# EAGLE design main_16 (EAGLE 7.4.0)
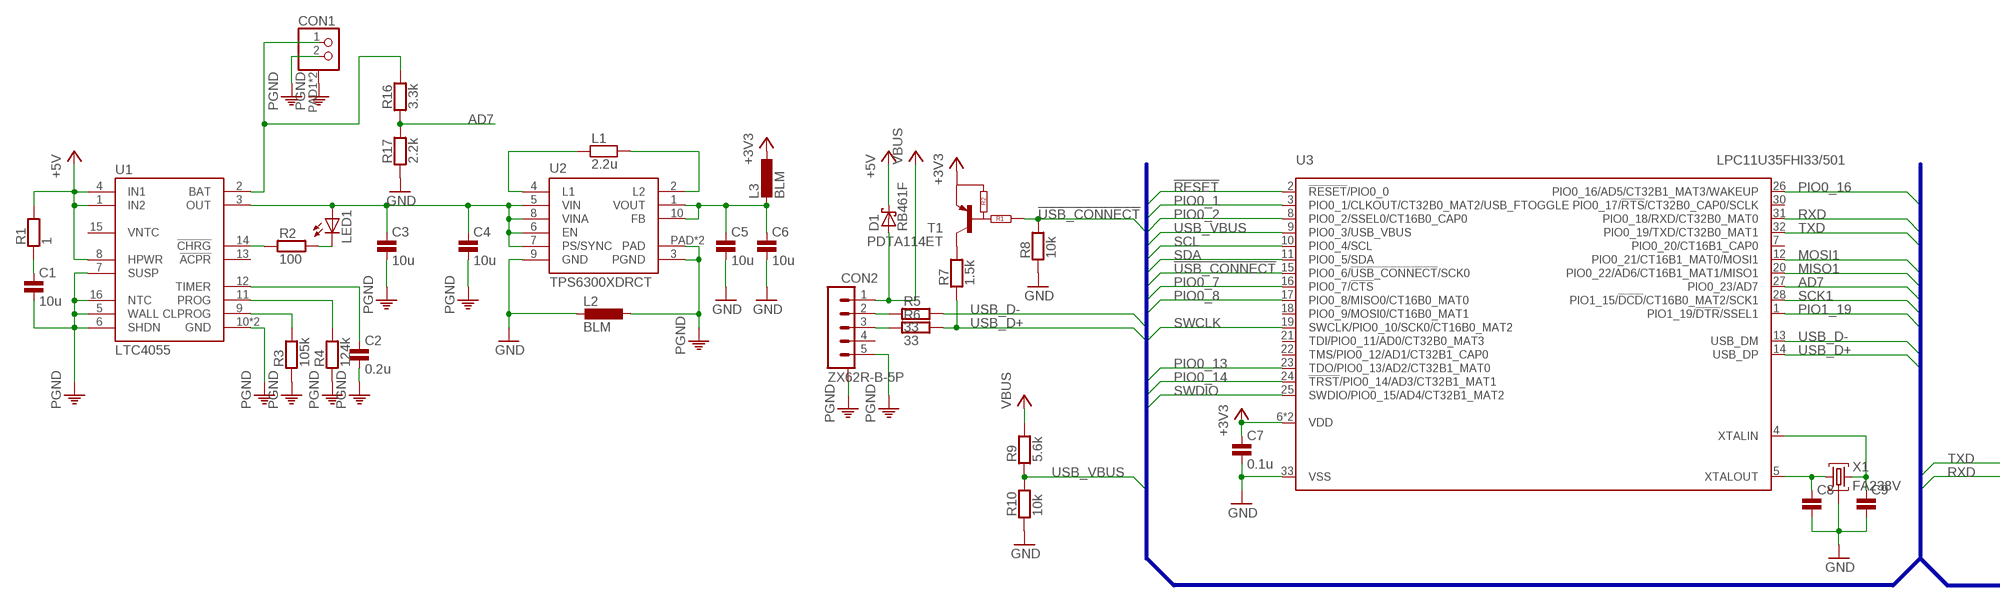
[diagram p0: schematic, sheet 1, part 1 of 2]
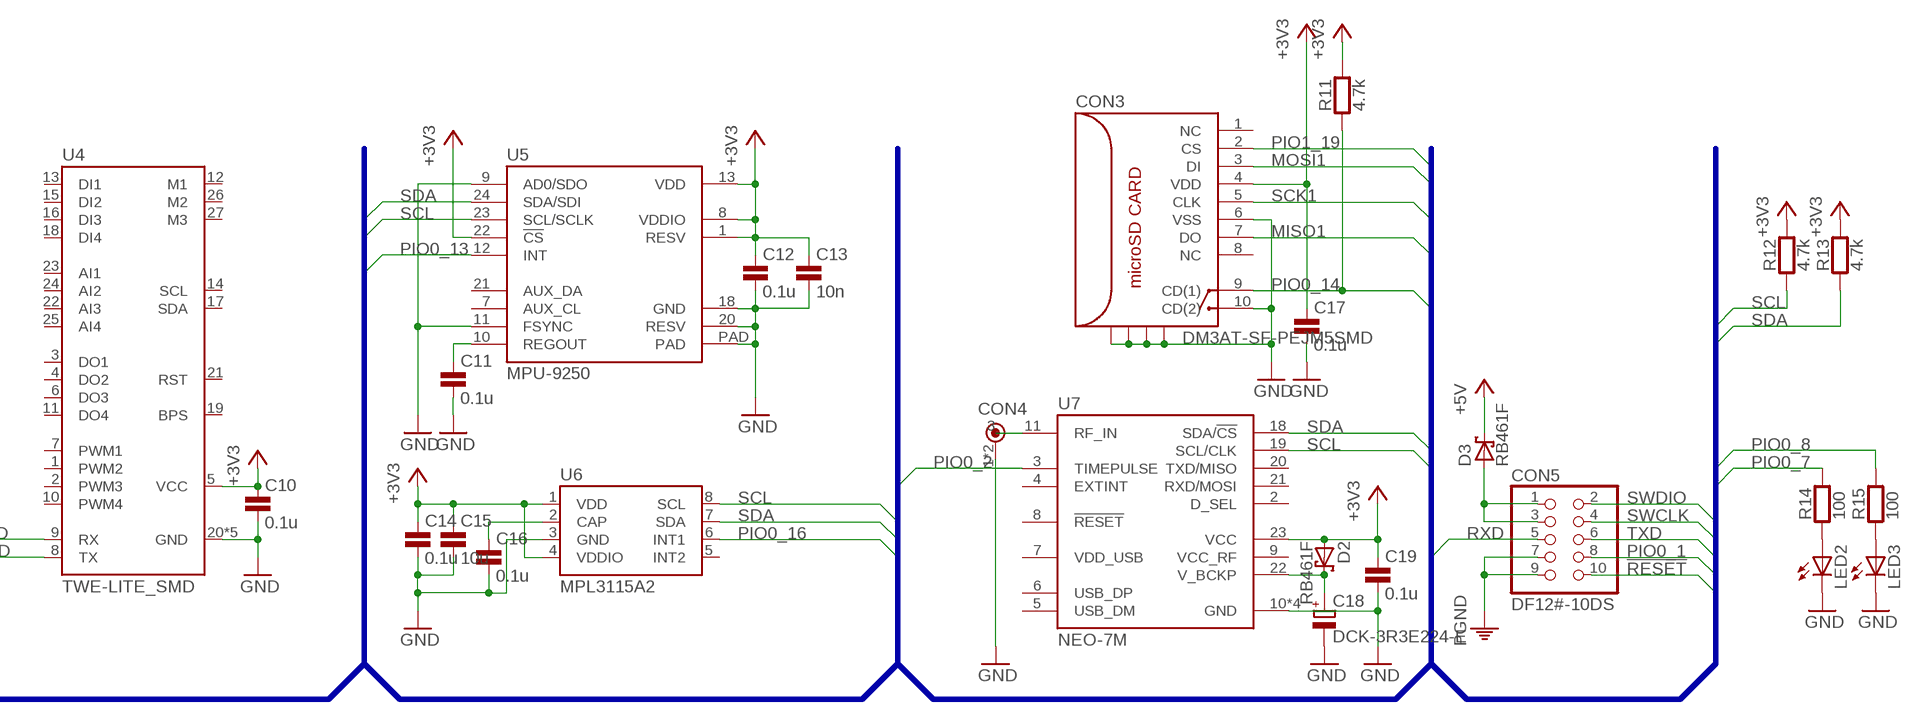
[diagram p1: schematic, sheet 1, part 2 of 2]

## Parts
C1  10u  C0603  [0603]
C2  0.2u  C0402  [0402]
C3  10u  C0603  [0603]
C4  10u  C0603  [0603]
C5  10u  C0603  [0603]
C6  10u  C0603  [0603]
C7  0.1u  C0402  [0402]
C8  C0402  [0402]
C9  C0402  [0402]
C10  0.1u  C0402  [0402]
C11  0.1u  C0402  [0402]
C12  0.1u  C0402  [0402]
C13  10n  C0402  [0402]
C14  0.1u  C0402  [0402]
C15  10u  C0402  [0402]
C16  0.1u  C0402  [0402]
C17  0.1u  C0402  [0402]
C18  DCK-3R3E224-E  [DCK-3R3E224-E]
C19  0.1u  C0402  [0402]
CON1  JST-PH2  [JST-PH2]
CON2  ZX62R-B-5P  [MICRO-B]
CON3  DM3AT-SF-PEJM5SMD  [DM3AT-SF-PEJM5]
CON4  U.FL  [U.FL-R-SMT-1]
CON5  DF12#-10DS  [DF12A-10DS]
D1  RB461F  [UMD3]
D2  RB461F  [UMD3]
D3  RB461F  [UMD3]
L1  2.2u  VLF4012ST  [VLF4012ST]
L2  BLM  L-EU  [C0603K]
L3  BLM  L-EU  [C0603K]
LED1  LEDSML0603  [SML0603]
LED2  LEDSML0603  [SML0603]
LED3  LEDSML0603  [SML0603]
R1  1  R0402  [0402]
R2  100  R0402  [0402]
R3  105k  R0402  [0402]
R4  124k  R0402  [0402]
R5  33  R0402  [0402]
R6  33  R0402  [0402]
R7  1.5k  R0402  [0402]
R8  10k  R0402  [0402]
R9  5.6k  R0402  [0402]
R10  10k  R0402  [0402]
R11  4.7k  R0402  [0402]
R12  4.7k  R0402  [0402]
R13  4.7k  R0402  [0402]
R14  100  R0402  [0402]
R15  100  R0402  [0402]
R16  3.3k  R0402  [0402]
R17  2.2k  R0402  [0402]
T1  PDTA114ET  [SOT23]
U1  LTC4055  [QFN16]
U2  TPS6300XDRCT  [S-PVSON-N10]
U3  LPC11U35FHI33/501  [SOT617-3]
U4  TWE-LITE_SMD  [LITE]
U5  MPU-9250  [MPU-9250]
U6  MPL3115A2  [MPL3115A2]
U7  NEO-7M  [NEO-7M]
X1  FA238V  [V66RA]

## Nets
!RESET!: CON5.10 U3.2(!RESET!/PIO0_0)
!USB_CONNECT!: R8.2 T1.1(INPUT) U3.15(PIO0_6/!USB_CONNECT!/SCK0)
+3V3: C7.1 C10.1 C12.1 C13.1 C14.1 C15.1 C17.1 C19.1 CON3.4(VDD) D2.2(A) L3.1 R11.2 R12.2 R13.2 T1.2(E) U3.6(VDD) U3.29(VDD) U4.5(VCC) U5.1(RESV) U5.8(VDDIO) U5.13(VDD) U5.22(!CS!) U6.1(VDD) U6.4(VDDIO) U7.23(VCC)
+5V: D1.3(C) D3.3(C) R1.2 U1.1(IN2) U1.4(IN1) U1.8(HPWR)
AD7: R16.1 R17.2 U3.27(PIO0_23/AD7)
GND: C5.2 C6.2 C7.2 C8.2 C9.2 C10.2 C11.2 C12.2 C13.2 C14.2 C15.2 C16.2 C17.2 C18.1(-) C19.2 CON3.6(VSS) CON3.10(CD(2)) CON3.P$10 CON3.P$11 CON3.P$12 CON3.P$14 CON4.1(GND) CON4.2(GND) L2.2 LED2.C LED3.C R8.1 R10.1 R17.1 U2.9(GND) U3.33(VSS) U4.20(GND) U4.28(GND) U4.30(GND) U4.31(GND) U4.32(GND) U5.9(AD0/SDO) U5.11(FSYNC) U5.18(GND) U5.20(RESV) U5.PAD U6.3(GND) U7.10(GND) U7.12(GND) U7.13(GND) U7.24(GND) X1.P2GND(GND) X1.P4GND(GND)
MISO1: CON3.7(DO) U3.20(PIO0_22/AD6/CT16B1_MAT1/MISO1)
MOSI1: CON3.3(DI) U3.12(PIO0_21/CT16B1_MAT0/MOSI1)
N$1: C8.1 U3.5(XTALOUT) X1.P1X1(X1)
N$2: CON2.2(2.D-) R5.1
N$3: C9.1 U3.4(XTALIN) X1.P3X2(X2)
N$4: CON2.3(3.D+) R6.1
N$5: R7.2 T1.3(C)
N$6: LED3.A R15.1
N$7: CON4.3(RF) U7.11(RF_IN)
N$8: C16.1 U6.2(CAP)
N$9: L1.2 U2.2(L2)
N$10: C11.1 U5.10(REGOUT)
N$11: L1.1 U2.4(L1)
N$12: LED2.A R14.1
N$16: C1.1 R1.1
N$17: C5.1 C6.1 L3.2 U2.1(VOUT) U2.10(FB)
N$18: CON5.1 CON5.3 D3.2(A)
N$19: R3.2 U1.9(CLPROG)
N$20: R4.2 U1.11(PROG)
N$21: C2.1 U1.12(TIMER)
N$22: R2.1 U1.14(!CHRG!)
N$23: LED1.C R2.2
N$24: C3.1 C4.1 LED1.A U1.3(OUT) U2.5(VIN) U2.6(EN) U2.7(PS/SYNC) U2.8(VINA)
N$25: CON1.1 R16.2 U1.2(BAT)
N$26: C18.2(+) D2.3(C) U7.22(V_BCKP)
PGND: C1.2 C2.2 C3.2 C4.2 CON1.2 CON1.PAD1 CON1.PAD2 CON2.5(5.GND) CON2.CASE@1 CON2.CASE@2 CON2.CASE@3 CON2.CASE@4 CON5.7 CON5.9 L2.1 R3.1 R4.1 U1.5(WALL) U1.6(SHDN) U1.7(SUSP) U1.10(GND) U1.16(NTC) U1.PAD(GND) U2.3(PGND) U2.PAD U2.PAD@1(PAD)
PIO0_1: CON5.8 U3.3(PIO0_1/CLKOUT/CT32B0_MAT2/USB_FTOGGLE)
PIO0_2: U3.8(PIO0_2/SSEL0/CT16B0_CAP0) U7.3(TIMEPULSE)
PIO0_7: R14.2 U3.16(PIO0_7/!CTS!)
PIO0_8: R15.2 U3.17(PIO0_8/MISO0/CT16B0_MAT0)
PIO0_13: U3.23(TDO/PIO0_13/AD2/CT32B1_MAT0) U5.12(INT)
PIO0_14: CON3.9(CD(1)) R11.1 U3.24(!TRST!/PIO0_14/AD3/CT32B1_MAT1)
PIO0_16: U3.26(PIO0_16/AD5/CT32B1_MAT3/WAKEUP) U6.6(INT1)
PIO1_19: CON3.2(CS) U3.1(PIO1_19/!DTR!/SSEL1)
RXD: CON5.5 U3.31(PIO0_18/RXD/CT32B0_MAT0) U4.8(TX)
SCK1: CON3.5(CLK) U3.28(PIO1_15/!DCD!/CT16B0_MAT2/SCK1)
SCL: R12.1 U3.10(PIO0_4/SCL) U5.23(SCL/SCLK) U6.8(SCL) U7.19(SCL/CLK)
SDA: R13.1 U3.11(PIO0_5/SDA) U5.24(SDA/SDI) U6.7(SDA) U7.18(SDA/!CS!)
SWCLK: CON5.4 U3.19(SWCLK/PIO0_10/SCK0/CT16B0_MAT2)
SWDIO: CON5.2 U3.25(SWDIO/PIO0_15/AD4/CT32B1_MAT2)
TXD: CON5.6 U3.32(PIO0_19/TXD/CT32B0_MAT1) U4.9(RX)
USB_D+: R6.2 R7.1 U3.14(USB_DP)
USB_D-: R5.2 U3.13(USB_DM)
USB_VBUS: R9.1 R10.2 U3.9(PIO0_3/USB_VBUS)
VBUS: CON2.1(1.VBUS) D1.2(A) R9.2
Unconnected: CON2.4(4.ID) CON3.1(NC) CON3.8(NC) U1.13(!ACPR!) U3.7(PIO0_20/CT16B1_CAP0) U3.18(PIO0_9/MOSI0/CT16B0_MAT1) U3.21(TDI/PIO0_11/AD0/CT32B0_MAT3) U3.22(TMS/PIO0_12/AD1/CT32B1_CAP0) U3.30(PIO0_17/!RTS!/CT32B0_CAP0/SCLK) U4.1(PWM2) U4.2(PWM3) U4.3(DO1) U4.4(DO2) U4.6(DO3) U4.7(PWM1) U4.10(PWM4) U4.11(DO4) U4.12(M1) U4.13(DI1) U4.14(SCL) U4.15(DI2) U4.16(DI3) U4.17(SDA) U4.18(DI4) U4.19(BPS) U4.21(RST) U4.22(AI3) U4.23(AI1) U4.24(AI2) U4.25(AI4) U4.26(M2) U4.27(M3) U5.7(AUX_CL) U5.21(AUX_DA) U6.5(INT2) U7.2(D_SEL) U7.4(EXTINT) U7.5(USB_DM) U7.6(USB_DP) U7.8(!RESET!) U7.9(VCC_RF) U7.20(TXD/MISO) U7.21(RXD/MOSI)

## Buses
PIO0_0,PIO0_1,PIO0_2,PIO0_3,PIO0_4,PIO0_5,PIO0_6,PIO0_7,PIO0_8,PIO0_9,PIO0_10,PIO0_11,PIO0_12,PIO0_13,PIO0_14,PIO0_15,PIO0_16,PIO0_17,PIO0_18,PIO0_19,PIO0_20,PIO0_21,PIO0_22,PIO0_23,PIO1_15,PIO1_19,!RESET!,SWCLK,SWDIO,RXD,TXD,SCL,SDA,MISO0,MOSI0,SCK0,MISO1,MOSI1,SCK1,AD1,AD7,USB_VBUS,!USB_CONNECT!,USB_D+,USB_D-

## Power pins joined to a net without a drawn wire
VDD_USB: U7.7(VDD_USB)
VNTC: U1.15(VNTC)

## Library data of the parts
C1-C17 C19 = untitled:C: CAPACITOR
C18 = untitled:DCK-3R3E224-E
CON1 = untitled:JST-PH2
CON2 = untitled:ZX62R-B-5P
CON3 = untitled:DM3AT-SF-PEJM5
CON4 = untitled:U.FL
CON5 = untitled:DF12#-10
D1-D3 = untitled:RB461F
L1 = untitled:VLF4012ST
L2 L3 = rcl:L-EU: INDUCTOR, European symbol
LED1-LED3 = led:LED: LED OSRAM: - CHIPLED LG R971, LG N971, LY N971, LG Q971, LY Q971, LO R971, LY R971 LH N974, LH R974 LS Q976, LO Q976, LY Q976 LO Q996 - Hyper CHIPLED LW Q18S LB Q993, LB Q99A, LB R99A - SideLED LS A670, LO A670, LY A670, LG A670, LP A670 LB A673, LV A673, LT A673, LW A673 LH A674 LY A675 LS A676, LA A676, LO A676, LY A676, LW A676 LS A679, LY A679, LG A679 - Hyper Micro SIDELED® LS Y876, LA Y876, LO Y876, LY Y876 LT Y87S - SmartLED LW L88C, LW L88S LB L89C, LB L89S, LG L890 LS L89K, LO L89K, LY L89K LS L896, LA L896, LO L896, LY L896 - TOPLED LS T670, LO T670, LY T670, LG T670, LP T670 LSG T670, LSP T670, LSY T670, LOP T670, LYG T670 LG T671, LOG T671, LSG T671 LB T673, LV T673, LT T673, LW T673 LH T674 LS T676, LA T676, LO T676, LY T676, LB T676, LH T676, LSB T676, LW T676 LB T67C, LV T67C, LT T67C, LS T67K, LO T67K, LY T67K, LW E67C LS E67B, LA E67B, LO E67B, LY E67B, LB E67C, LV E67C, LT E67C LW T67C LS T679, LY T679, LG T679 LS T770, LO T770, LY T770, LG T770, LP T770 LB T773, LV T773, LT T773, LW T773 LH T774 LS E675, LA E675, LY E675, LS T675 LS T776, LA T776, LO T776, LY T776, LB T776 LHGB T686 LT T68C, LB T68C - Hyper Mini TOPLED® LB M676 - Mini TOPLED Santana® LG M470 LS M47K, LO M47K, LY M47K Source: http://www.osram.convergy.de LUXEON: - LUMILED® LXK2-PW12-R00, LXK2-PW12-S00, LXK2-PW14-U00, LXK2-PW14-V00 LXK2-PM12-R00, LXK2-PM12-S00, LXK2-PM14-U00 LXK2-PE12-Q00, LXK2-PE12-R00, LXK2-PE12-S00, LXK2-PE14-T00, LXK2-PE14-U00 LXK2-PB12-K00, LXK2-PB12-L00, LXK2-PB12-M00, LXK2-PB14-N00, LXK2-PB14-P00, LXK2-PB14-Q00 LXK2-PR12-L00, LXK2-PR12-M00, LXK2-PR14-Q00, LXK2-PR14-R00 LXK2-PD12-Q00, LXK2-PD12-R00, LXK2-PD12-S00 LXK2-PH12-R00, LXK2-PH12-S00 LXK2-PL12-P00, LXK2-PL12-Q00, LXK2-PL12-R00 Source: www.luxeon.com KINGBRIGHT: KA-3528ASYC Source: www.kingbright.com
R1-R17 = untitled:R: RESISTOR
T1 = untitled:PDTA114: PNP Resistor-Equipped Transistor (RET) family in small Surface-Mounted Device (SMD) plastic packages. AAL Eindhoven MK
U1 = untitled:LTC4055
U2 = untitled:TPS6300XDRCT
U3 = untitled:LPC11U35FHI33: 32-bit ARM Cortex-M0 microcontroller; up to 128 kB flash; up to 12 kB SRAM and 4 kB EEPROM; USB device; USART The LPC11U3x are a ARM Cortex-M0 based, low-cost 32-bit MCU family, designed for 8/16-bit microcontroller applications, offering performance, low power, simple instruction set and memory addressing together with reduced code size compared to existing 8/16-bit architectures. The LPC11U3x operate at CPU frequencies of up to 50 MHz. Equipped with a highly flexible and configurable Full Speed USB 2.0 device controller, the LPC11U3x brings unparalleled design flexibility and seamless integration to today’s demanding connectivity solutions. The peripheral complement of the LPC11U3x includes up to 128 kB of flash memory, up to 12 kB of SRAM data memory and 4 kB EEPROM, one Fast-mode Plus I 2 C-bus interface, one RS-485/EIA-485 USART with support for synchronous mode and smart card interface, two SSP interfaces, four general purpose counter/timers, a 10-bit ADC, and up to 54 general purpose I/O pins. AAL Eindhoven MK; FLASH: 64kB; GPIO: 26; SRAM: 12kB
U4 = untitled:TWE-LITE
U5 = untitled:MPU-9250
U6 = untitled:MPL3115A2
U7 = untitled:NEO-7M
X1 = untitled:FA238V: EPSON TOYOCOM CRYSTAL V66RA package FA238V

## Board
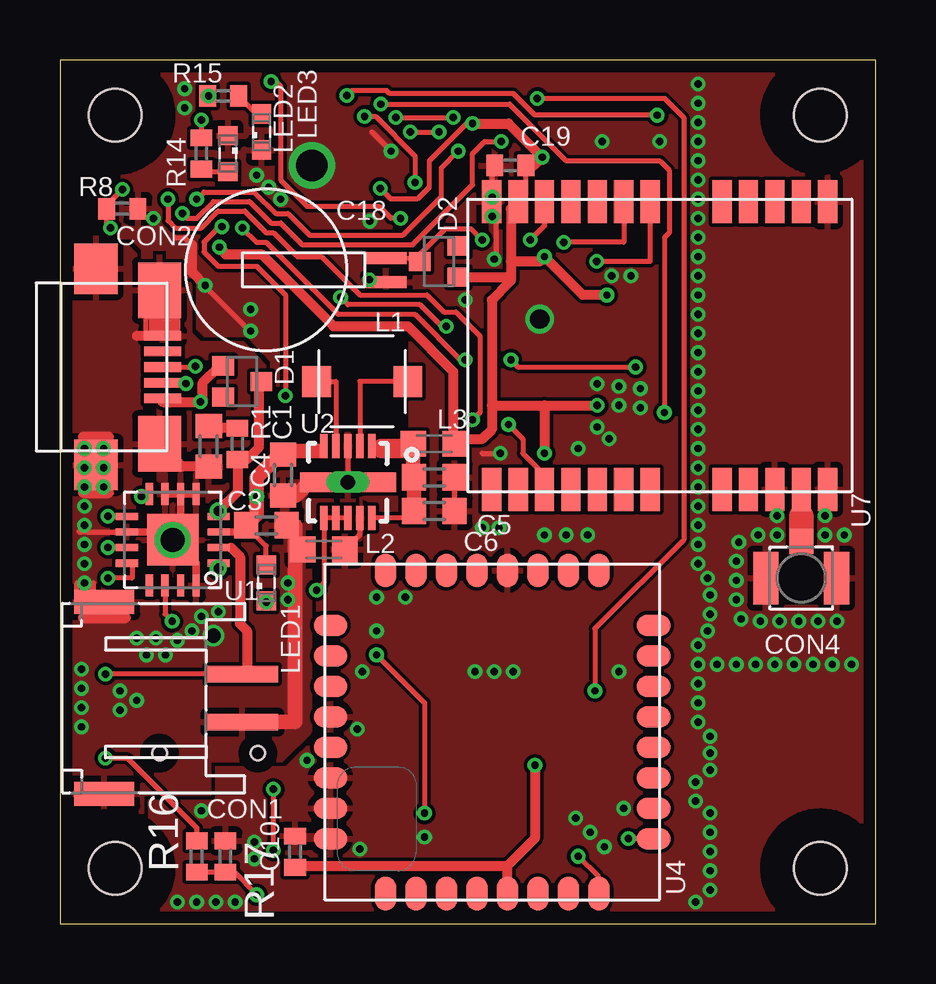
[diagram p2: board, top side]
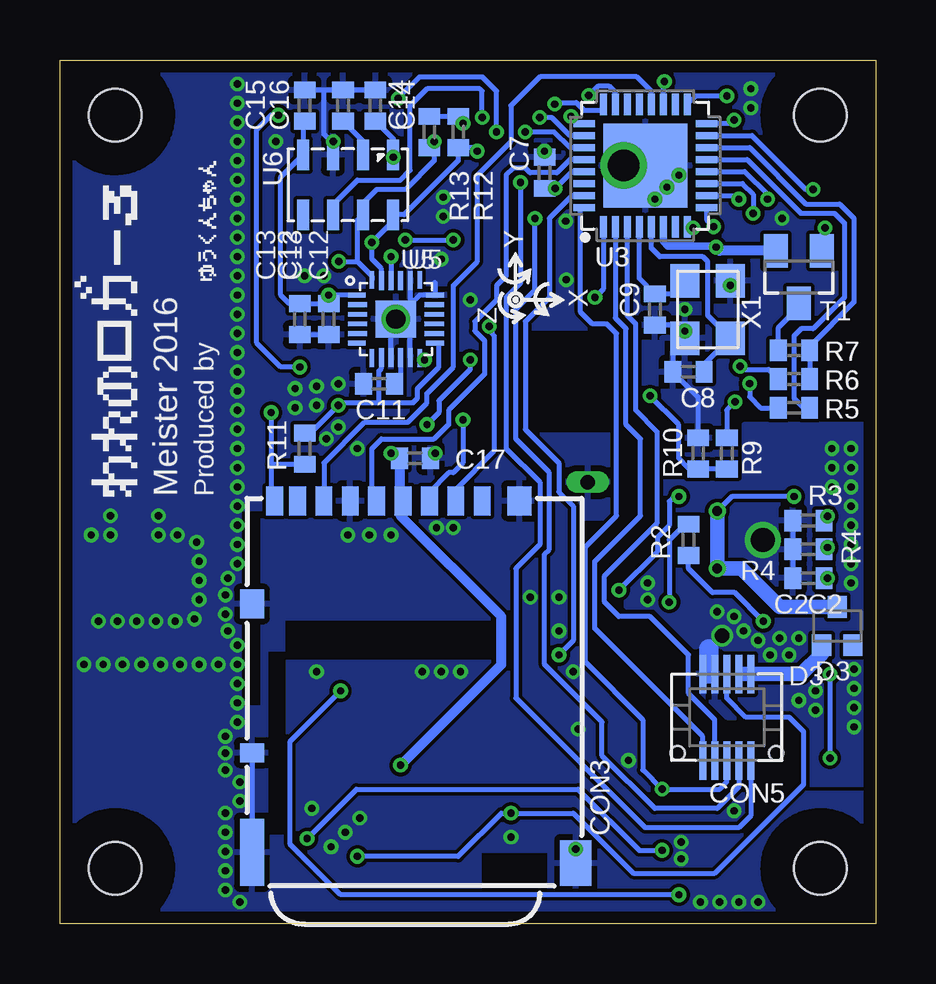
[diagram p3: board, bottom side, seen from below]

Size 34 x 36 mm. Coordinates in mm from the lower left corner, seen from the top.
Outline: 0,0 34,0 34,36 0,36 0,0
Copper layers (1*16): Top 0.035mm / dielectric 1.6mm / Bottom 0.035mm
Design rules "Elecrow_2-layer_PCB_eagle_rule *": minimum track width 6mil, minimum drill 12mil, track to track 6mil, track to pad 6mil, pad to pad 6mil, via to via 8mil, smd to smd 0mil, copper to edge 20mil, drill to drill 10mil, minimum pad ring 6mil, minimum via ring 6mil, stop-mask expansion 0mil, vias tented up to drill 100mil, thermal gap 10mil
Holes 2.2 mm at 2.3,2.3 31.7,2.3 2.3,33.7 31.7,33.7
tRestrict: area 0,0 to 4.6,4.6; area 29.4,0 to 34,4.6; area 0,31.4 to 4.6,36; area 29.4,31.4 to 34,36; area 11.2,20.6 to 14.4,24.6
bRestrict: area 0,0 to 4.6,4.6; area 29.4,0 to 34,4.6; area 11.2,20.6 to 14.4,24.6; area 0,31.4 to 4.6,36; area 29.4,31.4 to 34,36

### Footprints (pad centres in the part's own frame; a part is rotated, then mirrored left to right if it is on the bottom)
0603 = smd 1 x 1.1: 1 -0.85,0; 2 0.85,0
0402 = smd 0.7 x 0.9: 1 -0.65,0; 2 0.65,0
DCK-3R3E224-E = smd 0.5 x 1.7: 1 -0.5,0; 2 0.5,0
JST-PH2 = smd 0.7 x 3: 1 1,-3.7; 2 -1,-3.7 | smd 1 x 2.5: PAD1 4,2.05; PAD2 -4,2.05
MICRO-B = smd 0.4 x 1.55: 1 1.3,2.775; 2 0.65,2.775; 3 0,2.775; 4 -0.65,2.775; 5 -1.3,2.775 | smd 2.3 x 1.8: CASE@1 -3.2,2.65; CASE@2 3.2,2.65 | smd 2.1 x 1.8: CASE@3 -4.1,0; CASE@4 4.075,0
DM3AT-SF-PEJM5 = smd 0.7 x 1.2: 1 3.2,7.62; 2 2.1,7.62; 3 1,7.62; 4 -0.1,7.62; 5 -1.2,7.62; 6 -2.3,7.62; 7 -3.4,7.62; 8 -4.5,7.62; 9 -5.45,7.62 | smd 1 x 0.8: 10 -6.4,-2.88 | smd 1 x 1.2: P$10 4.75,7.62; P$12 -6.4,3.32 | smd 1.3 x 1.9: P$11 7.1,-7.48 | smd 1 x 2.8: P$14 -6.4,-7.03
U.FL-R-SMT-1 = smd 1.05 x 2.2: 1 -1.475,0; 2 1.475,0 | smd 1 x 1.05: 3 0,-1.525
DF12A-10DS = smd 0.3 x 1.6: 1 -1,-1.8; 2 -1,1.8; 3 -0.5,-1.8; 4 -0.5,1.8; 5 0,-1.8; 6 0,1.8; 7 0.5,-1.8; 8 0.5,1.8; 9 1,-1.8; 10 1,1.8 | hole 0.6: 2.05,1.5; -2.05,1.5
UMD3 = smd 0.8 x 0.9: 1 0.65,-0.8; 2 -0.65,-0.8; 3 0,0.8
VLF4012ST = smd 1.2 x 1.3: 1 1.9,0; 2 -1.9,0
C0603K = smd 1.05 x 1.08: 1 -0.875,0; 2 0.875,0
SML0603 = smd 0.8 x 0.8: A 0.75,0; C -0.75,0
SOT23 = smd 1 x 1.4: 1 -0.95,-1.1; 2 0.95,-1.1; 3 0,1.1
QFN16 = smd 0.92 x 0.3: 1 -1.91,0.975; 2 -1.91,0.325; 3 -1.91,-0.325; 4 -1.91,-0.975; 9 1.91,-0.975; 10 1.91,-0.325; 11 1.91,0.325; 12 1.91,0.975 | smd 0.3 x 0.92: 5 -0.975,-1.91; 6 -0.325,-1.91; 7 0.325,-1.91; 8 0.975,-1.91; 13 0.975,1.91; 14 0.325,1.91; 15 -0.325,1.91; 16 -0.975,1.91 | smd 2.15 x 2.15: PAD 0,0
S-PVSON-N10 = smd 0.3 x 1: 1 -1,-1.5; 2 -0.5,-1.5; 3 0,-1.5; 4 0.5,-1.5; 5 1,-1.5; 6 1,1.5; 7 0.5,1.5; 8 0,1.5; 9 -0.5,1.5; 10 -1,1.5 | smd 4 x 0.8: PAD 0,0 | drill 0.6 long: PAD@1 0,0
SOT617-3 = smd 0.9 x 0.29: 1 -2.55,1.75; 2 -2.55,1.25; 3 -2.55,0.75; 4 -2.55,0.25; 5 -2.55,-0.25; 6 -2.55,-0.75; 7 -2.55,-1.25; 8 -2.55,-1.75; 17 2.55,-1.75; 18 2.55,-1.25; 19 2.55,-0.75; 20 2.55,-0.25; 21 2.55,0.25; 22 2.55,0.75; 23 2.55,1.25; 24 2.55,1.75 | smd 0.29 x 0.9: 9 -1.75,-2.55; 10 -1.25,-2.55; 11 -0.75,-2.55; 12 -0.25,-2.55; 13 0.25,-2.55; 14 0.75,-2.55; 15 1.25,-2.55; 16 1.75,-2.55; 25 1.75,2.55; 26 1.25,2.55; 27 0.75,2.55; 28 0.25,2.55; 29 -0.25,2.55; 30 -0.75,2.55; 31 -1.25,2.55; 32 -1.75,2.55 | smd 3.5 x 3.5: 33 0,0
LITE = smd 1.4 x 0.9: 1 0.25,11.43; 2 0.25,10.16; 3 0.25,8.89; 4 0.25,7.62; 5 0.25,6.35; 6 0.25,5.08; 7 0.25,3.81; 8 0.25,2.54; 17 13.72,2.54; 18 13.72,3.81; 19 13.72,5.08; 20 13.72,6.35; 21 13.72,7.62; 22 13.72,8.89; 23 13.72,10.16; 24 13.72,11.43 | smd 0.9 x 1.4: 9 2.54,0.25; 10 3.81,0.25; 11 5.08,0.25; 12 6.35,0.25; 13 7.62,0.25; 14 8.89,0.25; 15 10.16,0.25; 16 11.43,0.25; 25 11.43,13.72; 26 10.16,13.72; 27 8.89,13.72; 28 7.62,13.72; 29 6.35,13.72; 30 5.08,13.72; 31 3.81,13.72; 32 2.54,13.72
MPU-9250 = smd 0.74 x 0.2: 1 -1.63,1; 6 -1.63,-1; 13 1.63,-1; 18 1.63,1 | smd 0.8 x 0.2: 2 -1.6,0.6; 3 -1.6,0.2; 4 -1.6,-0.2; 5 -1.6,-0.6; 14 1.6,-0.6; 15 1.6,-0.2; 16 1.6,0.2; 17 1.6,0.6 | smd 0.2 x 0.74: 7 -1,-1.63; 12 1,-1.63; 19 1,1.63; 24 -1,1.63 | smd 0.2 x 0.8: 8 -0.6,-1.6; 9 -0.2,-1.6; 10 0.2,-1.6; 11 0.6,-1.6; 20 0.6,1.6; 21 0.2,1.6; 22 -0.2,1.6; 23 -0.6,1.6 | smd 1.7 x 1.54: PAD 0,0
MPL3115A2 = smd 1.27 x 0.5: 1 -1.25,1.875; 2 -1.25,0.625; 3 -1.25,-0.625; 4 -1.25,-1.875; 5 1.25,-1.875; 6 1.25,-0.625; 7 1.25,0.625; 8 1.25,1.875
NEO-7M = smd 1.8 x 0.8: 1 12.1,1; 2 12.1,2.1; 3 12.1,3.2; 4 12.1,4.3; 5 12.1,5.4; 6 12.1,6.5; 7 12.1,7.6; 8 12.1,10.6; 9 12.1,11.7; 10 12.1,12.8; 11 12.1,13.9; 12 12.1,15; 13 0.1,15; 14 0.1,13.9; 15 0.1,12.8; 16 0.1,11.7; 17 0.1,10.6; 18 0.1,7.6; 19 0.1,6.5; 20 0.1,5.4; 21 0.1,4.3; 22 0.1,3.2; 23 0.1,2.1; 24 0.1,1
V66RA = smd 1.4 x 1.2: P1X1 -1.2,-0.95; P2GND 1.2,-0.95; P3X2 1.2,0.95; P4GND -1.2,0.95

### Placement (x,y rotation side)
C1  6.2,19.9 270 top
C2  2.8,14.4 180 bottom
C3  8.6,16.6 0 top
C4  9.3,18.7 270 top
C5  15.6,18.6 0 top
C6  15.6,17.2 0 top
C7  13.8,31.3 90 bottom
C8  7.8,23 180 bottom
C9  9.2,25.6 270 bottom
C10  9.8,3 90 top
C11  20.7,22.5 180 bottom
C12  22.8,25.2 270 bottom
C13  24,25.2 270 bottom
C14  20.85,34.1 90 bottom
C15  23.8,34.1 90 bottom
C16  22.2,34.1 90 bottom
C17  19.2,19.4 0 bottom
C18  13.6,27.25 90 top
C19  18.77,31.6 180 top
CON1  3.9,9.4 90 top
CON2  1.5,23.2 270 top
CON3  19.6,10 0 bottom
CON4  30.9,14.4 180 top
CON5  6.2,8.6 180 bottom
D1  7.6,22.6 270 top
D2  15.8,27.6 90 top
D3  1.6,12.4 0 bottom
L1  12.6,22.6 180 top
L2  11,15.6 0 top
L3  15.6,20 180 top
LED1  8.6,14.2 90 top
LED2  7,32.1 270 top
LED3  8.4,33 90 top
R1  7.4,20 270 top
R2  7.8,16 90 bottom
R3  2.8,16.8 0 bottom
R4  2.8,15.6 0 bottom
R5  3.4,21.5 0 bottom
R6  3.4,22.7 0 bottom
R7  3.4,23.9 180 bottom
R8  2.6,29.8 180 top
R9  6.2,19.6 90 bottom
R10  7.4,19.6 270 bottom
R11  23.8,19.8 90 bottom
R12  17.4,33 90 bottom
R13  18.6,33 90 bottom
R14  5.9,32.1 90 top
R15  6.8,34.5 180 top
R16  5.7,2.8 90 top
R17  6.9,2.8 270 top
T1  3.2,26.95 180 bottom
U1  4.7,16 180 top
U2  12,18.4 180 top
U3  9.6,31.6 90 bottom
U4  25,1 90 top
U5  20,25.2 0 bottom
U6  22,30.8 270 bottom
U7  17,30.2 270 top
U$1  [DIRECTION]  15,26 90 bottom
X1  7,25.6 90 bottom

### Tracks (layer width: path | path; a pad name or v marks a point on that pad's centre or on a via)
!RESET!
  Bottom 0.203: U3.2 10.85,25.25 10.4,24.8 10.4,20.8 9.8,20.2 9.8,17 11.7,15.1 11.7,12.3 7.2,7.8 CON5.10
!USB_CONNECT!  (via drill 0.3)
  Top 0.203: v2.6,30.6 1.95,29.95 R8.2 1.95,29.15 v2.1,29
  Bottom 0.203: U3.15 5.15,32.85 2.9,30.6 v2.6,30.6 | v2.1,29 2.25,28.85 T1.1
+3V3  (via drill 0.3)
  Top 0.203: C10.1 9.8,2.4 10,2.2 10,2.4 | 16.68,20.2 L3.1 | v13.35,30.65 13.8,30.2 14.9,30.2 15.4,30.7 15.4,31.8 16.95,33.35 v17.2,33.35 | U7.23 19.43,30.1 C19.1
  Top 0.305: U4.5 18.65,1.6
  Top 0.406: 10,2.4 18.65,2.4 | v22.8,26.2 21.8,26.2 v20.2,27.8 20,27.6 18.8,27.6 | 18.7,26.7 18.8,26.8 18.8,27.6 | 18.7,26.7 18,26 18,21.6 | U7.23 18.8,29.8 18.8,27.6 | 16.68,20.2 17.6,20.2 18,20.6 18,21.6 | 18,21.6 20.2,21.6 | 20.2,21.6 v20.2,19.6 | C19.1 19.75,31.6 v20.1,31.95 18.7,33.35 v17.2,33.35 | 20.2,21.6 v22.4,21.6 | 18.65,1.6 18.65,2.4 | v19.8,6.6 19.8,3.55 18.65,2.4 | 16.4,20 16.4,23 14.5,24.9 11.4,24.9 8.4,27.9 6.9,27.9 6.9,27.95 v6.65,28.2 | D2.2 18.7,26.95 18.7,26.7
  Top 0.61: 16.4,20 L3.1
  Bottom 0.203: C15.1 23.88,33.38 U6.4 24.8,31.12 24.8,26.2 24.45,25.85 C13.1 C12.1 v22.8,26.2 U5.1 | v6.65,28.2 6.7,28.25 | 20.7,21.7 19.3,21.7 19.1,21.9 19.1,22.3 18.2,23.2 18.2,24.2 U5.13 | 20.7,21.7 20.7,23.04 20.6,23.14 U5.8 | v20.2,27.8 U5.22 | 19.65,17.67 CON3.4 19.8,17.62 19.85,17.62 | U3.29 12.65,31.35 v13.35,30.65 C7.1 | v20.2,19.6 19.65,19.6 C17.1 | R11.2 23.55,20.45 v22.4,21.6 22.3,21.7 20.7,21.7 | R13.2 R12.2 17.2,33.65 v17.2,33.35 | U6.1 20.12,31.98 v20.1,31.95 20.1,32.7 C14.1
  Bottom 0.305: 6.7,28.25 8.65,28.25 8.85,28.45 U3.6
  Bottom 0.406: v19.8,6.6 15.6,10.8 15.6,12.8 19.8,17 19.8,17.62 | v6.65,28.2 6.5,28.05 4.45,28.05 T1.2 | C17.1 19.85,17.62
+5V  (via drill 0.3, 0.41)
  Top 0.203: v3.4,17.8 v3.41,17.81 3.73,17.81 U1.8
  Top 0.305: U1.1 v6.6,14.8 | v6.6,17.2 U1.4
  Top 0.406: v6.6,17.2 7.4,18 R1.2 7.8,19.35 8.3,19.85 8.3,22.6 D1.3
  Bottom 0.203: v3.4,17.8 6,17.8 v6.6,17.2
  Bottom 0.61: v6.6,17.2 v6.6,14.8 5.6,14.8 4,13.2 D3.3
AD7  (via drill 0.3)
  Top 0.203: v19.9,34.4 25.2,34.4 26,33.6 26,16 22.3,12.3 v22.3,9.7 | R16.1 R17.2 7.25,2.15 v8.2,1.2 | v14.6,33 v15.8,33
  Bottom 0.203: v19.9,34.4 19,35.3 16.4,35.3 15.8,34.7 v15.8,33 | v8.2,1.2 22.3,1.2 24.4,3.3 24.4,7.6 v22.3,9.7 | U3.27 12.75,32.35 13.4,33 v14.6,33
GND  (via drill 0.3, 0.8, 1.3)
  Top 0.203: C6.2 C5.2 16.6,18.6 | C10.2 9.8,3.54 | U7.13 32,30.8 | 17.6,19.6 v18.35,19.6 | 4.8,28.6 5.2,28.6 5.5,28.3 | v7.95,24.7 7.95,24.65 6.05,26.55 v6.05,26.6 | C19.2 18,31.6 U7.24 18.2,30.1 18.2,27.8 v18.1,27.7 | v13.8,32.2 13,33 | U2.9 12.5,16.23 L2.2 | v12.9,26.84 13.6,26.84 C18.1
  Top 0.406: v6.05,26.6 5.5,27.15 5.5,28.3
  Bottom 0.203: 19.4,25.8 19,26.2 U5.18 18.37,26.73 | 19.4,25.8 U5.PAD | U5.20 19.4,25.8 | U5.PAD 19.4,25.2 U5.11 19.4,24.6 U5.PAD | C13.2 C12.2 | C14.2 C16.2 23,34.75 | 23,34.75 C15.2 | U6.3 22.62,32.52 23,32.9 23,34.75 | 26,13.4 CON3.P$12 | CON3.10 CON3.P$14 | C9.2 8.2,24.95 v7.95,24.7 8.45,24.2 C8.2 7.4,21.95 R10.1 | C7.2 v13.8,32.2 | 12.5,1.8 CON3.P$11 | v18.35,19.6 C17.2 | U5.9 20.2,25.2 U5.PAD | 11,33 11,32.1 v10.5,31.6 | U3.33 8.9,31.6
  other vias: 20,25.2 29.9,17 31.9,17 29.9,16.2 31.9,16.2 29.1,16.2 28.3,15.9 28.2,15.1 28.2,14.3 28.2,13.5 28.4,12.7 29.2,12.6 30,12.6 30.8,12.6 32.7,16.2 26.6,31 26.6,32.6 26.6,34.2 26.6,35 12.4,8.1 4.9,0.9 26.6,31.8 26.6,26.2 26.6,27.8 26.6,28.6 26.6,29.4 26.6,30.2 26.6,27 26.6,21.4 26.6,23 26.6,23.8 26.6,24.6 26.6,25.4 26.6,22.2 26.6,16.6 26.6,18.2 26.6,19 26.6,19.8 26.6,20.6 26.6,17.4 26.6,11.6 26.6,15 26.6,15.8 31.4,10.8 29.8,10.8 29,10.8 28.2,10.8 27.4,10.8 30.6,10.8 26.6,10.8 27,14.4 27.1,13.7 27.1,12.9 31.6,12.6 32.4,12.6 32.2,10.8 33,10.8 12.92,29.28 12.6,10.5 5.7,0.9 6.5,0.9 7.3,0.9 18.02,30.28 18.02,29.48 23,27 23.8,27 14.4,13.6 13.2,13.6 22.4,22.5 23.3,22.4 23.3,21.6 24.2,22.3 24.2,21.5 25,32.6 26.6,33.4 26.6,10 26.6,9.2 26.6,8.4 27.1,7.8 27.1,7.1 27.1,6.4 26.5,5.9 26.5,5.1 27,12.2 27.1,4.6 27.1,3.8 27.1,3 27.1,2.2 27.1,1.4 26.5,0.9 22,16.2 21.1,16.2 20.2,16.2 5.2,34.8 22.6,32.6 5.9,4.7 8.1,2.7 10.3,6.8 13.2,12.2 9.2,30.2 8.7,30.7 8.2,31.2 18.3,16.5 17.6,16.5 21.6,19.8 22.4,20.7 22.89,20.21 5.2,34 8.1,3.4 17.3,10.5 18.1,10.5 18.9,10.5 22.7,3.2 22.1,3.8 21.5,4.4 23.3,10.5 23.5,4.8 15.2,3.6 12.5,3.1 16.9,26 7.95,25.6 3.9,29.4
  pour Top (rank 2): 0,36 0,0 34,0 34,36
  pour Bottom (rank 2): 0,36 34,36 34,0 0,0
MISO1
  Bottom 0.203: CON3.7 23,19.2 21.3,20.9 19.5,20.9 18.7,21.7 18.7,22.1 17.6,23.2 17.6,26.6 16.6,27.6 16.6,31.2 15.2,32.6 15.2,34.1 14,35.3 9.95,35.3 9.35,34.7 U3.20
MOSI1  (via drill 0.3)
  Top 0.203: v17.2,21 17.5,21.3 17.5,24.5 16.5,25.5 16,25.5 15.3,26.2 12.5,26.2 10.9,27.8 9.9,27.8 8.9,28.8 8.6,28.8 7.7,29.7 6.6,29.7 5.9,29 4.8,29 4.5,29.3 v4.5,30.2
  Bottom 0.203: U3.12 5.45,31.35 4.5,30.4 v4.5,30.2 | v17.2,21 17.2,19.2 17.6,18.8 17.8,18.8 18.6,18 CON3.3
N$1
  Bottom 0.203: C8.1 7.15,23.3 X1.P1X1 7,25.35 7,27.6 7.2,27.8 9,27.8 9.35,28.15 U3.5
N$2  (via drill 0.3)
  Top 0.203: CON2.2 5.21,22.55 v5.25,22.51
  Bottom 0.203: v5.25,22.51 5.25,21.95 4.8,21.5 R5.1
N$3
  Bottom 0.203: X1.P3X2 8.5,26.25 C9.1 9.85,26.9 U3.4
N$4  (via drill 0.3)
  Top 0.203: CON2.3 5.62,23.2 v5.65,23.23
  Bottom 0.203: v5.65,23.23 5.52,23.1 4.45,23.1 R6.1
N$5
  Bottom 0.203: R7.2 4.05,24.85 3.2,25.7 T1.3
N$6
  Top 0.203: R15.1 8.2,33.75 LED3.A
N$7
  Top 0.813: U7.11 30.9,17
  Top 1.016: 30.9,17 CON4.3
N$8
  Bottom 0.203: C16.1 21.38,32.62 U6.2
N$9
  Top 0.203: L1.2 12.5,22.6 U2.2
N$10
  Bottom 0.203: U5.10 19.8,22.5 C11.1
N$11
  Top 0.203: L1.1 11.5,22.6 U2.4
N$12
  Top 0.203: R14.1 6,31.35 LED2.A
N$16
  Top 0.406: R1.1 6.2,20.65 C1.1
N$17
  Top 0.203: U2.10 14.75,16.9 C6.1 | 14.72,18.8 14.72,18.6 C5.1
  Top 0.305: 13.4,19.8 13,19.8 U2.1
  Top 0.61: C5.1 C6.1 | L3.2 14.72,19.8 14.72,18.8
  Top 0.813: 13.4,19.8 14.72,19.8
N$18
  Bottom 0.203: 5.5,10.4 CON5.3
  Bottom 0.605: CON5.1 5.5,10.4
  Bottom 0.61: D3.2 2.25,11.25 3.1,10.4 CON5.1
N$19  (via drill 0.3)
  Top 0.203: U1.9 v2,16.98
  Bottom 0.203: v2,16.98 2.15,16.98 R3.2
N$20  (via drill 0.3)
  Top 0.203: U1.11 v2,15.68
  Bottom 0.203: v2,15.68 2.15,15.68 R4.2
N$21  (via drill 0.3)
  Top 0.203: U1.12 3,15.03 3,14.4 v2,14.4
  Bottom 0.203: v2,14.4 C2.1
N$22  (via drill 0.3)
  Top 0.203: U1.14 4.38,12.9 v4.67,12.6
  Bottom 0.203: v4.67,12.6 5.88,13.8 6.8,13.8 7.8,14.8 R2.1
N$23  (via drill 0.3)
  Top 0.203: v8.6,13.4 LED1.C
  Bottom 0.203: R2.2 7.85,16.6 8,16.6 8.6,16 v8.6,13.4
N$24  (via drill 0.3)
  Top 0.203: LED1.A 8.6,15.75 C3.1 | U2.8 U2.7 U2.6 11,14.2 v10.7,13.9 | U2.5 11,19.7 10.8,19.7
  Top 0.305: 6.92,16.32 U1.3 7.75,16.32 C3.1
  Top 0.61: C3.1 8.2,17.05 v8.2,17.8 8.2,18.6 9.15,19.55 C4.1 9.3,19.7 10.8,19.7
  Bottom 0.203: v10.7,13.9 9.1,15.5 9.1,16.1 8.6,16.6 8.6,17.6 8.4,17.8 v8.2,17.8
N$25  (via drill 0.3)
  Top 0.203: 7.4,10.4 v1.9,10.4 | v1.9,6.9 2.8,6.9 5.7,4 R16.2
  Top 0.305: 7.4,10.4 CON1.1 | U1.2 7.12,15.68
  Top 0.406: 7.4,10.4 7.8,10.4 7.8,12.2 7.5,12.5 7.5,15.3 7.12,15.68
  Bottom 0.203: v1.9,10.4 v1.9,6.9
N$26  (via drill 0.3)
  Top 0.203: U7.22 20.2,29.1 v19.6,28.5 | v17.6,28.5 17.15,28.95 16.05,28.95 15,27.9 D2.3 14.85,27.75 C18.2
  Bottom 0.203: v19.6,28.5 v17.6,28.5
PGND  (via drill 0.3, 0.6, 1)
  Top 0.203: CON1.PAD1 0.8,13.4 0.7,13.5 0.7,14.2 0.9,14.2 0.9,13.8 1.1,13.8 1.1,14.2 1.3,14.2 1.3,13.8 1.4,13.8 1.4,14.2 | 0.8,16.32 U1.10 | CON2.CASE@4 0.8,19.12 | CON2.CASE@2 4.47,20 | U2.3 U2.PAD@1 | 9.85,17.85 C4.2 | CON2.CASE@1 4.28,26.27 CON2.5 | 3.6,24.6 3.6,25.3 3.8,25.3 3.8,24.6 4,24.6 4,25.3 4.2,25.3 4.2,24.6 4.4,24.6 4.4,25.3 4.6,25.3 4.6,24.6 4.8,24.6 4.8,25.3 4.9,25.3 4.9,24.6
  Top 0.305: U1.6 5.03,16 U1.PAD | U1.7 U1.6 | U1.6 U1.5 | U1.16 5.67,15.03 U1.PAD | U1.10 4.7,16.32 U1.PAD
  Top 0.406: C1.2 5.1,19.05 CON2.CASE@2 | 1.5,20.3 2.05,20.3 | 1.5,17.95 2.05,17.95 | 0.95,20.3 1.5,20.3 | 1.5,20.3 CON2.CASE@4 1.5,17.95 | 0.95,17.95 1.5,17.95 | 0.95,12.75 2.4,12.75 | 2.4,12.75 2.75,12.75 | 0.8,13.4 2.4,13.4 2.4,12.75 | 3.6,24.5 3.2,24.5
  Top 0.61: 9.8,16.6 9.8,8.4 CON1.2 | U2.PAD@1 10.4,18.4 9.85,17.85
  Bottom 0.203: R3.1 R4.1 C2.2 | CON5.9 6.95,10.4 CON5.7 | 6.95,11.45 v6.4,12
  Bottom 0.813: 6.95,10.4 6.95,11.45
  other vias: 4.7,16 1.02,19.8 6.6,13 5.9,12.8 5.5,12.2 4.9,11.8 4.4,11.2 3.6,11.2 3.2,11.9 4,11.9 9.5,13.5 9.5,14.2 0.9,10.6 0.9,9.8 0.9,9 2.5,9.7 2.5,8.9 3.2,9.3 0.9,8.2 1.02,19 1.82,19.8 1.82,19 1.02,18.2 1.82,18.2 1.02,17.4 1.02,16.6 1.02,15.8 1.02,15 1.02,14.2
  pour Top: 0,28.6 2.4,28.6 3.2,27.8 5.2,27.8 5.4,27.6 5.4,24.6 5.8,24.2 7.6,24.2 8.8,22.9 8.8,22 9.2,21.6 9.6,21.6 9.8,21.8 9.8,23.6 11,24.8 14.2,24.8 15.4,23.6 15.4,21.7 13.9,20.2 13.9,16.9 10.4,16.9 10.4,8 9.2,6.8 6.2,6.8 6.2,5.4 3.4,5.4 3.4,4.6 0,4.6
  pour Bottom: 0,5.8 0,20.8 5.5,20.8 5.5,18.4 9.5,18.4 9.5,21.2 9.8,21.5 9.8,23.6 11,24.8 14.6,24.8 14.6,20.4 13.9,20.4 13.9,16.9 10.4,16.9 10.4,13.2 9.2,13.2 7.4,11.4 7.4,9.8 6.2,8.6 3.6,8.6 3,8 3,5.8
PIO0_1
  Bottom 0.203: U3.3 10.35,25.35 10,25 10,21.4 9.1,20.5 9.1,16.7 11.3,14.5 11.3,13.4 10.7,12.8 9.4,12.8 7.8,11.2 7.8,9.6 6.7,8.5 CON5.8
PIO0_2  (via drill 0.3)
  Top 0.203: v7.6,29 8.2,28.4 8.6,28.4 11.6,25.4 14.8,25.4 16.7,23.5 v16.9,23.5 | v18.7,20.8 19.3,20.2 19.3,19.6 20.2,18.7 U7.3
  Bottom 0.203: U3.8 7.65,29.05 v7.6,29 | v16.9,23.5 16.9,23.1 18.2,21.8 18.2,21.3 v18.7,20.8
PIO0_7  (via drill 0.3)
  Top 0.203: R14.2 v5.9,33.5
  Bottom 0.203: v5.9,33.5 6.05,33.35 U3.16
PIO0_8  (via drill 0.3)
  Top 0.203: v6.2,34.5 R15.2
  Bottom 0.203: v6.2,34.5 7.5,34.5 U3.17
PIO0_13  (via drill 0.3)
  Top 0.203: v18.8,23.5 19.1,23.2 v24,23.2 | v24.9,33.7 19.8,33.7 18.9,34.6 13.74,34.6 13.62,34.72 12.16,34.72 v11.96,34.52
  Bottom 0.203: U3.23 10.85,34.65 11.1,34.9 11.58,34.9 v11.96,34.52 | U5.12 19,23.5 v18.8,23.5 | v24,23.2 24.8,23.2 25.8,24.2 25.8,33.1 25.2,33.7 v24.9,33.7
PIO0_14  (via drill 0.3)
  Top 0.203: v13.38,34.16 18.74,34.16 21.1,31.8 25,31.8 25.4,31.4 25.4,28.8 25.2,28.6 v25.2,21.3
  Bottom 0.203: v25.2,21.3 25.2,19.15 | 25.2,19.15 25.2,17.62 CON3.9 | 25.2,19.15 R11.1 | v13.38,34.16 13.32,34.22 12.47,34.22 12.15,33.9 11.35,33.9 U3.24
PIO0_16  (via drill 0.3)
  Top 0.203: v14,33.6 v16.4,33.6
  Bottom 0.203: U3.26 12.74,32.85 13.49,33.6 v14,33.6 | U6.6 22.6,29.57 22.6,30 21.6,31 19.8,31 19.4,31.4 19.4,34.1 18.7,34.8 16.5,34.8 16.4,34.7 v16.4,33.6
PIO1_19  (via drill 0.3)
  Top 0.203: v16.1,24.9 15.9,24.9 15,25.8 12,25.8 v11.7,26.1
  Bottom 0.203: CON3.2 17.5,18.1 15.9,19.7 15.9,24.5 16,24.6 16,24.8 v16.1,24.9 | U3.1 11.35,26.45 v11.7,26.1
RXD  (via drill 0.3)
  Top 0.203: U4.8 22.46,1.94 v21.6,2.8 | v13.2,11.2 15.2,9.2 v15.2,4.6
  Bottom 0.203: v21.6,2.8 17.4,2.8 15.6,4.6 v15.2,4.6 12.6,4.6 10.1,2.1 6.7,2.1 3,5.8 3,8 3.6,8.6 5.4,8.6 6.2,9.4 CON5.5 | U3.31 12.65,30.35 13.6,29.4 13.6,26.1 14.6,25.1 14.6,20.6 13.2,19.2 13.2,18 12.6,17.4 12.6,11.8 v13.2,11.2
SCK1
  Bottom 0.203: CON3.5 21,17.62 21,19.8 20.6,20.2 18.4,20.2 17.8,20.8 17.8,21.4 16.3,22.9 16.3,24.3 16.7,24.7 16.7,25.1 15.8,26 15.8,26.6 15.4,27 15.4,31.2 15.1,31.5 14.6,31.5 14.4,31.3 13.29,31.3 12.74,31.85 U3.28
SCL  (via drill 0.3)
  Top 0.203: v5.7,30.2 6,30.5 8.1,30.5 9,29.6 9.5,29.6 10.4,28.7 14.3,28.7 15.9,30.3 15.9,31.5 v16.6,32.2 | U7.19 23.5,28.4 v21,28.4
  Bottom 0.203: U5.23 20.6,27.3 21,27.7 v21,28.4 20.12,29.27 U6.8 | U3.10 5.85,30.35 v5.7,30.2 | 20.12,29.6 U6.8 | 20.12,30 U6.8 | v16.6,32.2 16.75,32.35 R12.1 17.4,31.8 19.65,29.55 U6.8
SDA  (via drill 0.3)
  Top 0.203: v5.1,29.6 5.3,29.4 5.7,29.4 6.4,30.1 7.9,30.1 8.8,29.2 9.2,29.2 10.1,28.3 14.7,28.3 17.2,30.8 17.2,32.1 17.7,32.6 v18.4,32.6 | U7.18 24.6,27.6 v22.38,27.6
  Bottom 0.203: 21.6,27.6 21.6,29.32 U6.7 21.38,30.02 20.8,30.6 19.6,30.6 18.4,31.8 v18.4,32.6 18.35,32.6 R13.1 | U3.11 5.55,30.85 5.1,30.4 v5.1,29.6 | v22.38,27.6 21.6,27.6 | 21.6,27.6 21,27 U5.24 21,26.8
SWCLK  (via drill 0.3)
  Top 0.203: v14.2,29.4 13.8,29.4 13.3,29.9 10.3,29.9 9.2,31 9.2,34.9 9,35.1 v8.8,35.1
  Bottom 0.203: U3.19 8.85,35.1 v8.8,35.1 | v14.2,29.4 14.2,26.4 15,25.6 15,20.2 13.6,18.8 13.6,15.6 13.8,15.4 13.8,10.8 11.4,8.4 11.4,7 9.2,4.8 6.6,4.8 5.7,5.7 CON5.4
SWDIO  (via drill 0.3)
  Top 0.203: v12.7,33.65 13.15,33.65 14.8,32 v14.8,30.9
  Bottom 0.203: v14.8,30.9 14.8,26.7 15.4,26.1 15.4,19.8 14,18.4 14,15.8 15,14.8 15,9.4 9.6,4 5.7,4 5.2,4.5 CON5.2 | v12.7,33.65 12.4,33.35 U3.25
TXD  (via drill 0.3)
  Top 0.203: U4.9 v23.7,3.54 | v8.9,3.05 v8.9,5.6
  Bottom 0.203: v23.7,3.54 21.64,5.6 12.4,5.6 9.85,3.05 v8.9,3.05 | CON5.6 6.2,5.9 6.5,5.6 v8.9,5.6 9.7,6.4 9.7,8.5 12.1,10.9 12.1,15.7 10.8,17 10.8,24.6 11.2,25 11.8,25 12.3,25.5 12.3,29.85 U3.32
USB_D+
  Bottom 0.203: U3.14 5.25,32.35 2.9,30 1.5,30 0.9,29.4 0.9,25.9 2.75,24.05 R7.1 R6.2
USB_D-
  Bottom 0.203: U3.13 5.35,31.85 3.1,29.6 1.7,29.6 1.3,29.2 1.3,26.1 2.6,24.8 3.1,24.8 3.4,24.5 3.4,21.9 3,21.5 R5.2
USB_VBUS  (via drill 0.3)
  Top 0.203: v9.4,22 9.4,26.2 8.2,27.4 6.6,27.4 6,28 6,28.4 6.65,29.05 v6.75,29.05
  Bottom 0.203: R9.1 R10.2 7.8,18.95 7.8,19 8.2,19.4 8.2,20.8 v9.4,22 | U3.9 7.05,29.35 v6.75,29.05
VBUS  (via drill 0.3)
  Top 0.406: CON2.1 4.28,21.75 v5.85,21.75 5.95,21.85 5.95,22.55 6.65,23.25 D1.2
  Bottom 0.203: v5.85,21.75 6.2,21.4 R9.2

### Text on the board
bPlace: Y | X | Z | Produced by | Meister 2016
_tNames: R15 | LED3 | C19 | LED2 | R8 | R14 | C18 | D2 | CON2 | L1 | D1 | R1 | C1 | U2 | L3 | C4 | U7 | C3 | C5 | L2 | C6 | U1 | CON4 | LED1 | CON1 | C10 | R16 | R17 | U4
_bNames: C14 | C16 | C15 | U6 | C7 | R12 | R13 | C12 | C13 | U3 | U5 | T1 | X1 | C9 | R7 | R6 | C8 | C11 | R5 | R9 | R10 | C17 | R11 | R3 | R4 | R2 | C2 | D3 | CON3 | CON5